# EAGLE design miniboard-schem (EAGLE 9.6.2)
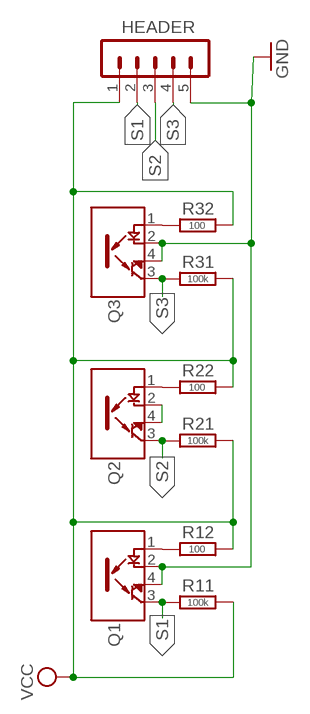
[diagram p0: schematic, sheet 1]

## Parts
HEADER  0  MA05-1  [MA05-1]
Q1  QRE1113  [DIP400W50P180L360H200Q4]
Q2  QRE1113  [DIP400W50P180L360H200Q4]
Q3  QRE1113  [DIP400W50P180L360H200Q4]
R11  100k  R-EU_0207/10  [0207/10]
R12  100  R-EU_0207/10  [0207/10]
R21  100k  R-EU_0207/10  [0207/10]
R22  100  R-EU_0207/10  [0207/10]
R31  100k  R-EU_0207/10  [0207/10]
R32  100  R-EU_0207/10  [0207/10]

## Nets
GND: HEADER.5 Q1.2(C) Q1.4(ET) Q3.2(C) Q3.4(ET)
N$3: Q3.1(A) R32.2
N$4: Q2.1(A) R22.2
N$6: Q2.2(C) Q2.4(ET)
N$7: Q1.1(A) R12.2
S1: HEADER.2 Q1.3(CT) R11.2
S2: HEADER.3 Q2.3(CT) R21.2
S3: HEADER.4 Q3.3(CT) R31.2
VCC: HEADER.1 R11.1 R12.1 R21.1 R22.1 R31.1 R32.1

## Library data of the parts
HEADER = con-lstb:MA05-1: PIN HEADER; OC_FARNELL: unknown; OC_NEWARK: unknown
Q1-Q3 = QRE1113-2:QRE1113: Reflective object sensor; AVAILABILITY: Unavailable; DESCRIPTION: OPTOCOUPLER, PHOTOTRANSISTOR; No. of Channels: 1; Optocoupler Output Type: Phototr; MANUFACTURER: On Semiconductor; MP: QRE1113; PACKAGE: DIP-4 ON Semiconductor; PARTREV: 5; PRICE: None; STANDARD: IPC-7251
R11 R12 R21 R22 R31 R32 = rcl:R-EU_: RESISTOR, European symbol; SPICEPREFIX: R

## Board
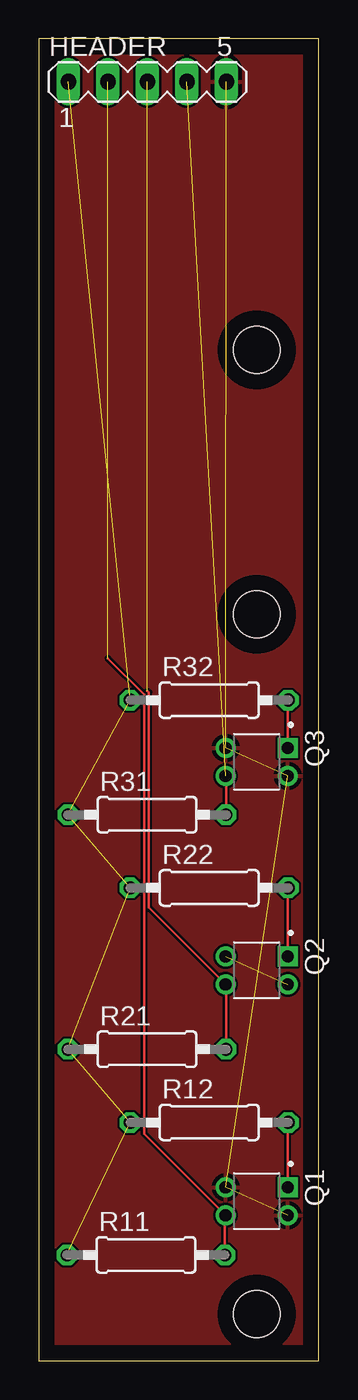
[diagram p1: board, top side]
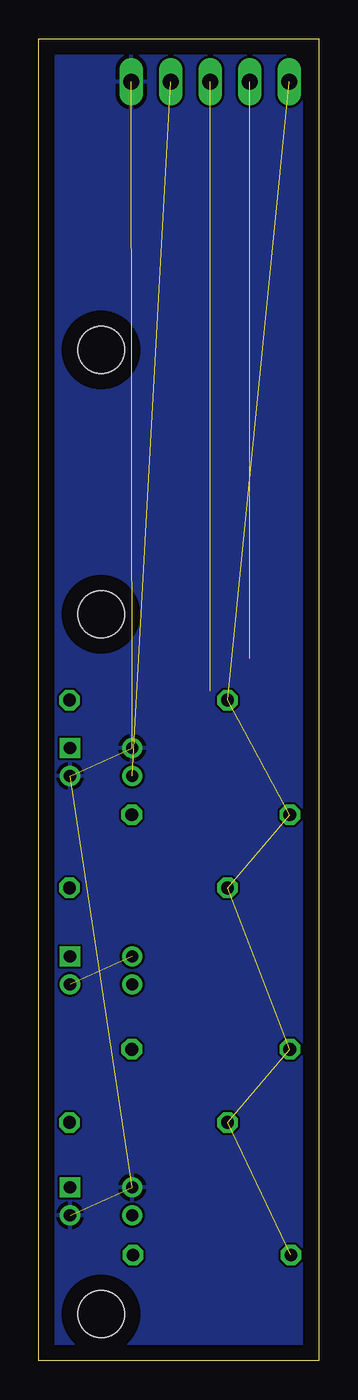
[diagram p2: board, bottom side, seen from below]

Size 18 x 85 mm. Coordinates in mm from the lower left corner, seen from the top.
Outline: 0,0 18,0 18,85 0,85 0,0
Copper layers (1*16): Top 0.035mm / dielectric 1.5mm / Bottom 0.035mm
Design rules "default": minimum track width 6mil, minimum drill 0.35mm, track to track 6mil, track to pad 6mil, pad to pad 6mil, via to via 6mil, smd to smd 6mil, copper to edge 40mil, drill to drill 6mil, minimum pad ring 10mil, minimum via ring 8mil, stop-mask expansion 4mil, vias tented up to drill 0mil, thermal gap 10mil
Holes 3 mm at 14,3 14,48 14,65

### Footprints (pad centres in the part's own frame; a part is rotated, then mirrored left to right if it is on the bottom)
MA05-1 = drill 1.016 long: 1 -5.08,0; 2 -2.54,0; 3 0,0; 4 2.54,0; 5 5.08,0
DIP400W50P180L360H200Q4 = drill 0.78 square: 1 -0.9,2 | drill 0.78: 2 -0.9,-2; 3 0.9,-2; 4 0.9,2
0207/10 = drill 0.813 octagon: 1 -5.08,0; 2 5.08,0

### Placement (x,y rotation side)
HEADER  6.98,82.24 0 top
Q1  14,10.25 270 top
Q2  14,25.1 270 top
Q3  14,38.5 270 top
R11  6.88,6.8 0 top
R12  10.95,15.32 0 top
R21  6.95,20.02 0 top
R22  10.95,30.4 0 top
R31  6.95,35.1 0 top
R32  10.95,42.48 0 top

### Tracks (layer width: path | path; a pad name or v marks a point on that pad's centre or on a via)
GND  (4 unrouted)
  pour Top: 0,85 18,85 18,0 0,0
  pour Bottom: 0,85 18,85 18,0 0,0
N$3
  Top 0.152: Q3.1 16,42.45 R32.2
N$4
  Top 0.152: Q2.1 16,30.37 R22.2
N$6  (1 unrouted)
N$7
  Top 0.152: Q1.1 16,15.29 R12.2
S1  (1 unrouted)
  Top 0.152: R11.2 11.96,9.31 Q1.3 6.76,14.59 6.76,42.85 4.44,45.17
S2  (1 unrouted)
  Top 0.152: R21.2 12.03,24.17 Q2.3 7.06,29.14 7.06,42.97 6.98,43.06
S3  (1 unrouted)
  Top 0.152: R31.2 12.03,37.57 Q3.3
VCC  (6 unrouted)